# Altium schematic sheet SFP_TEMP_EEPROM_GPIO.SchDoc
size C; CompanyName: Atom Computing; Organization: Altium Limited; Address1: 918 Parker St.; Address2: Suite A-13; Address3: Berkeley, CA; Address4: 94710; Revision: B.2; SheetNumber: 4; SheetTotal: 4; PageSetup: Record=PageOptions|CenterHorizontal=True|CenterVertical=True|PrintScale=1.09|XCorrection=1.00|YCorrection=1.00|PrintKind=1|BorderSize=5000000|LeftOffset=0|BottomOffset=0|Orientation=2|PaperLength=4318|PaperWidth=2794|Scale=100|PaperSource=1025|PrintQuality=600|MediaType=256|DitherType=0|PrintScaleMode=1|PaperKind=11" x 17"|PaperIndex=17; Size: C; DescriptionA: ENGINEERING RELEASE; ReleaseYear: 2024; BoardTitle: MICRO HDMI INTERFACE
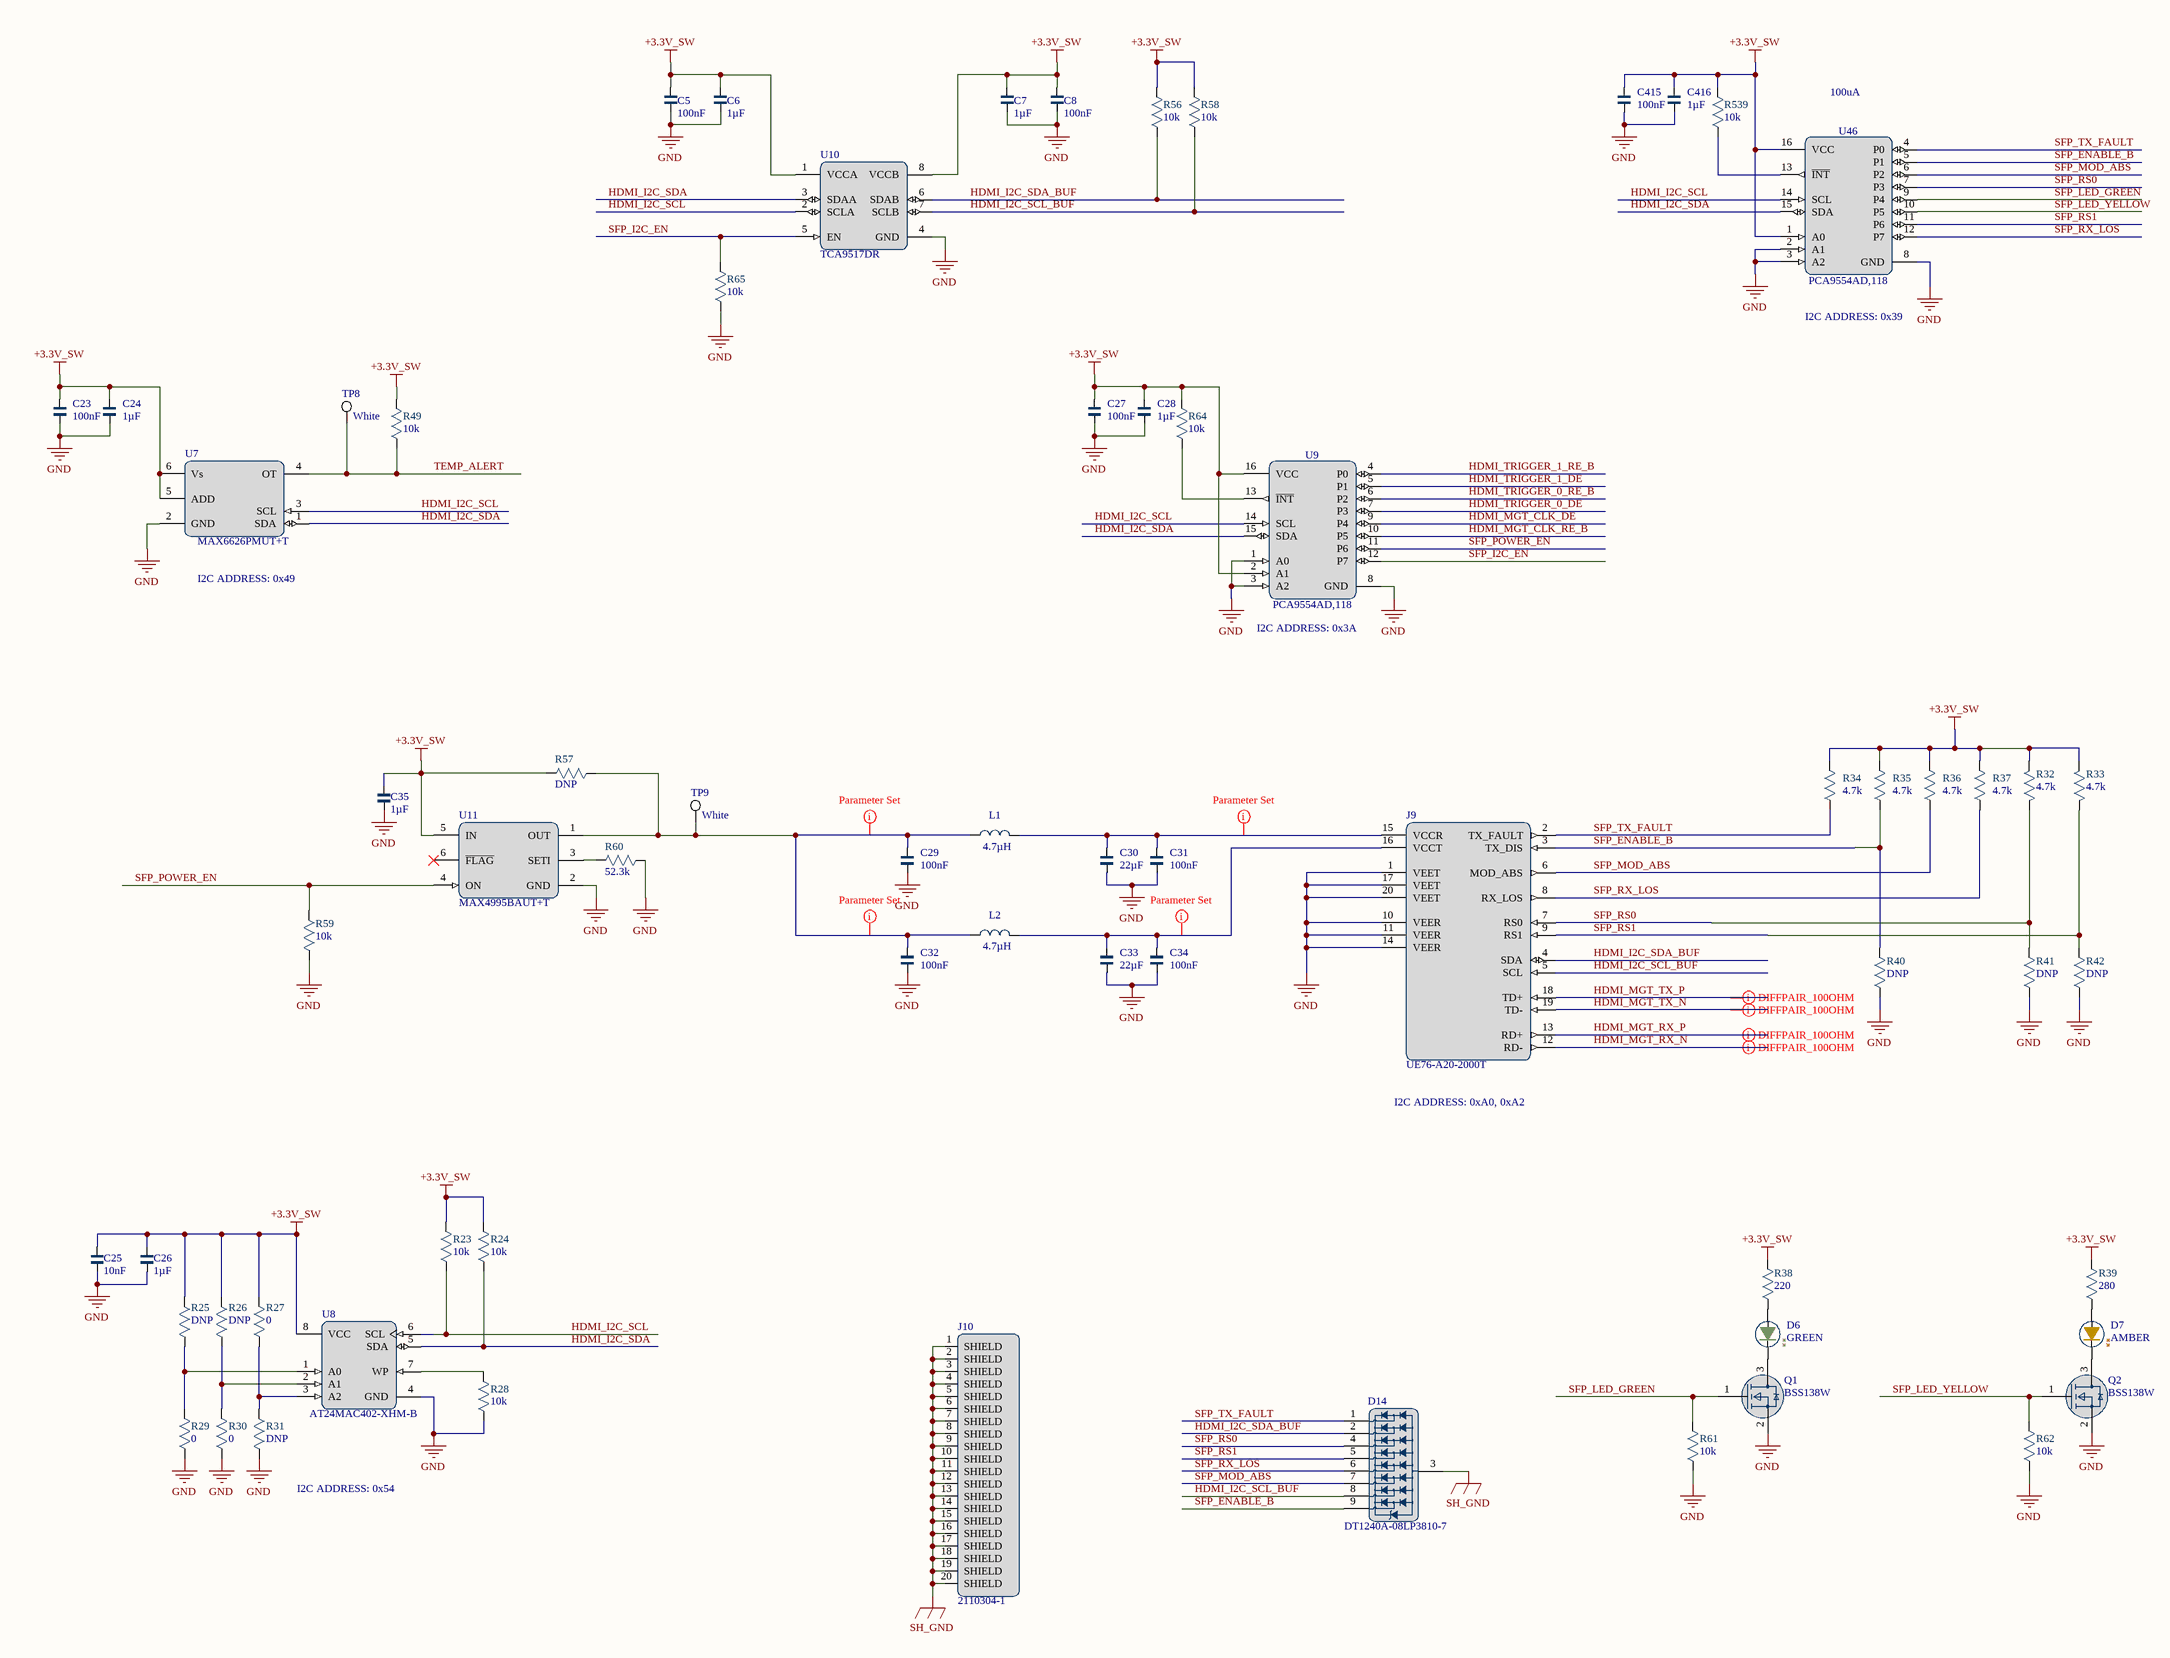
[diagram p0: SFP_TEMP_EEPROM_GPIO.SchDoc]

## Parts
C5  100nF  [CAPC160X80X95L35]
C6  1µF  [CAPC160X80X95L35]
C7  1µF  [CAPC160X80X95L35]
C8  100nF  [CAPC160X80X95L35]
C23  100nF  [CAPC160X80X95L35]
C24  1µF  [CAPC160X80X95L35]
C25  10nF  [CAPC160X80X95L35]
C26  1µF  [CAPC160X80X95L35]
C27  100nF  [CAPC160X80X95L35]
C28  1µF  [CAPC160X80X95L35]
C29  100nF  [CAPC160X80X95L35]
C30  22µF  [CAPC320X160X90L50]
C31  100nF  [CAPC160X80X95L35]
C32  100nF  [CAPC160X80X95L35]
C33  22µF  [CAPC320X160X90L50]
C34  100nF  [CAPC160X80X95L35]
C35  1µF  [CAPC160X80X95L35]
C415  100nF  [CAPC160X80X95L35]
C416  1µF  [CAPC160X80X95L35]
D6  GREEN  [BROADCOM_HSMX-C120]
D7  AMBER  [BROADCOM_HSMX-C120]
D14  DT1240A-08LP3810-7  [DIODES_DT1240A-08LP3810-7]
J9  UE76-A20-2000T  [AMPHENOL_UX76-A20-X00XX]
J10  2110304-1  [TE_2110304-1_NO_KEEPOUT]
L1  4.7µH  [VISHAY_IHLP-2020BZ]
L2  4.7µH  [VISHAY_IHLP-2020BZ]
Q1  BSS138W  [SOT23-3P65_210X110L36X22]
Q2  BSS138W  [SOT23-3P65_210X110L36X22]
R23  10k  [RESC160X85X55L30]
R24  10k  [RESC160X85X55L30]
R25  DNP  [RESC160X85X55L30]
R26  DNP  [RESC160X85X55L30]
R27  0  [RESC160X85X55L30]
R28  10k  [RESC160X85X55L30]
R29  0  [RESC160X85X55L30]
R30  0  [RESC160X85X55L30]
R31  DNP  [RESC160X85X55L30]
R32  4.7k  [RESC160X85X55L30]
R33  4.7k  [RESC160X85X55L30]
R34  4.7k  [RESC160X85X55L30]
R35  4.7k  [RESC160X85X55L30]
R36  4.7k  [RESC160X85X55L30]
R37  4.7k  [RESC160X85X55L30]
R38  220  [RESC160X85X55L30]
R39  280  [RESC160X85X55L30]
R40  DNP  [RESC160X85X55L30]
R41  DNP  [RESC160X85X55L30]
R42  DNP  [RESC160X85X55L30]
R49  10k  [RESC160X85X55L30]
R56  10k  [RESC160X85X55L30]
R57  DNP  [RESC160X85X55L30]
R58  10k  [RESC160X85X55L30]
R59  10k  [RESC160X85X55L30]
R60  52.3k  [RESC160X85X55L30]
R61  10k  [RESC160X85X55L30]
R62  10k  [RESC160X85X55L30]
R64  10k  [RESC160X85X55L30]
R65  10k  [RESC160X85X55L30]
R539  10k  [RESC160X85X55L30]
TP8  White  [Keystone_5002]
TP9  White  [Keystone_5002]
U7  MAX6626PMUT+T  [SOT23-6P95_280X145L45X42]
U8  AT24MAC402-XHM-B  [SOP8P65_300X640X120L60X24]
U9  PCA9554AD,118  [SOIC16P127_1030X1032X265L83X42]
U10  TCA9517DR  [SOIC8P127_490X599X175L84X41]
U11  MAX4995BAUT+T  [SOT23-6P95_280X145L45X42]
U46  PCA9554AD,118  [SOIC16P127_1030X1032X265L83X42]

## Nets
+3.3V_SW: C5.1 C6.1 C7.1 C8.1 C23.1 C24.1 C25.1 C26.1 C27.1 C28.1 C35.1 C415.1 C416.2 R23.2 R24.2 R25.1 R26.1 R27.2 R32.2 R33.2 R34.2 R35.2 R36.2 R37.2 R38.2 R39.2 R49.2 R56.2 R57.2 R58.2 R64.2 R539.2 U7.5(ADD) U7.6(Vs) U8.8(VCC) U9.2(A1) U9.16(VCC) U10.1(VCCA) U10.8(VCCB) U11.5(IN) U46.1(A0) U46.16(VCC)
GND: C5.2 C6.2 C7.2 C8.2 C23.2 C24.2 C25.2 C26.2 C27.2 C28.2 C29.2 C30.2 C31.2 C32.2 C33.2 C34.2 C35.2 C415.2 C416.1 J9.1(VEET) J9.10(VEER) J9.11(VEER) J9.14(VEER) J9.17(VEET) J9.20(VEET) Q1.2(SOURCE) Q2.2(SOURCE) R28.1 R29.1 R30.1 R31.2 R40.1 R41.1 R42.1 R59.2 R60.1 R61.1 R62.1 R65.1 U7.2(GND) U8.4(GND) U9.1(A0) U9.3(A2) U9.8(GND) U10.4(GND) U11.2(GND) U46.2(A1) U46.3(A2) U46.8(GND)
SH_GND: D14.3(GND) J10.1(SHIELD) J10.2(SHIELD) J10.3(SHIELD) J10.4(SHIELD) J10.5(SHIELD) J10.6(SHIELD) J10.7(SHIELD) J10.8(SHIELD) J10.9(SHIELD) J10.10(SHIELD) J10.11(SHIELD) J10.12(SHIELD) J10.13(SHIELD) J10.14(SHIELD) J10.15(SHIELD) J10.16(SHIELD) J10.17(SHIELD) J10.18(SHIELD) J10.19(SHIELD) J10.20(SHIELD)
HDMI_I2C_SCL: R23.1 U7.3(SCL) U8.6(SCL) U9.14(SCL) U10.2(SCLA) U46.14(SCL)
HDMI_I2C_SCL_BUF: D14.8(LINE-4) J9.5(SCL) R58.1 U10.7(SCLB)
HDMI_I2C_SDA: R24.1 U7.1(SDA) U8.5(SDA) U9.15(SDA) U10.3(SDAA) U46.15(SDA)
HDMI_I2C_SDA_BUF: D14.2(LINE-3) J9.4(SDA) R56.1 U10.6(SDAB)
HDMI_MGT_CLK_DE: U9.9(P4)
HDMI_MGT_CLK_RE_B: U9.10(P5)
HDMI_MGT_RX_N: J9.12(RD-)
HDMI_MGT_RX_P: J9.13(RD+)
HDMI_MGT_TX_N: J9.19(TD-)
HDMI_MGT_TX_P: J9.18(TD+)
HDMI_TRIGGER_0_DE: U9.7(P3)
HDMI_TRIGGER_0_RE_B: U9.6(P2)
HDMI_TRIGGER_1_DE: U9.5(P1)
HDMI_TRIGGER_1_RE_B: U9.4(P0)
SFP_ENABLE_B: D14.9(LINE-2) J9.3(TX_DIS) R35.1 R40.2 U46.5(P1)
SFP_I2C_EN: R65.2 U9.12(P7) U10.5(EN)
SFP_LED_GREEN: Q1.1(GATE) R61.2 U46.9(P4)
SFP_LED_YELLOW: Q2.1(GATE) R62.2 U46.10(P5)
SFP_MOD_ABS: D14.7(LINE-5) J9.6(MOD_ABS) R36.1 U46.6(P2)
SFP_POWER_EN: R59.1 U9.11(P6) U11.4(ON)
SFP_RS0: D14.4(LINE-6) J9.7(RS0) R32.1 R41.2 U46.7(P3)
SFP_RS1: D14.5(LINE-8) J9.9(RS1) R33.1 R42.2 U46.11(P6)
SFP_RX_LOS: D14.6(LINE-7) J9.8(RX_LOS) R37.1 U46.12(P7)
SFP_TX_FAULT: D14.1(LINE-1) J9.2(TX_FAULT) R34.1 U46.4(P0)
TEMP_ALERT: R49.1 TP8.1 U7.4(OT)
NetC29_1: C29.1 C32.1 L1.1 L2.1 R57.1 TP9.1 U11.1(OUT)
NetC30_1: C30.1 C31.1 J9.15(VCCR) L1.2
NetC33_1: C33.1 C34.1 J9.16(VCCT) L2.2
NetD6_1: D6.1 Q1.3(DRAIN)
NetD6_2: D6.2 R38.1
NetD7_1: D7.1 Q2.3(DRAIN)
NetD7_2: D7.2 R39.1
NetR25_2: R25.2 R29.2 U8.1(A0)
NetR26_2: R26.2 R30.2 U8.2(A1)
NetR27_1: R27.1 R31.1 U8.3(A2)
NetR28_2: R28.2 U8.7(WP)
NetR60_2: R60.2 U11.3(SETI)
NetR64_1: R64.1 U9.13(~{INT})
NetR539_1: R539.1 U46.13(~{INT})

Not connected (* = marked no-connect by the designer): U11 6(~{FLAG})*

## Layout directives
net class P-G: NetC29_1, NetC30_1, NetC33_1
differential pair; differential pair class 100DIFF: HDMI_MGT_RX_N, HDMI_MGT_RX_P, HDMI_MGT_TX_N, HDMI_MGT_TX_P

## Notes on the sheet
- 100uA
- I2C ADDRESS: 0x39
- I2C ADDRESS: 0x49
- (near U9) I2C ADDRESS: 0x3A
- I2C ADDRESS: 0xA0, 0xA2
- I2C ADDRESS: 0x54
- SCHEMATIC,
- "This documentation describes Open Hardware and is licensed under the CC BY-SA 4.0. You may redistribute and modify this documentation under the terms of
- CC BY-SA 4.0. (https://creativecommons.org/licenses/by-sa/4.0/). This documentation is distributed WITHOUT ANY EXPRESS OR IMPLIED WARRANTY,
- INCLUDING OF MERCHANTABILITY, SATISFACTORY QUALITY AND FITNESS FOR A PARTICULAR PURPOSE."  COPYRIGHT ©
- Atom Computing, Inc.
- ,
- SIZE
- FILE NAME
- PAGE
- OF
- REV

## Library data of the parts
C5 C8 C23 C27 = CMP-001-00143-7: CAP CER 0.1UF 25V X7R 0603; Mfg: Kemet; Tolerance: 10%; Mfg PN: C0603X104K3RACTU; Voltage: 25V; Pins: 2; VALUE: 100nF; Case/Package: 0603; Temp Coeff: X7R
C6 C7 C24 C28 = CMP-001-00135-7: CAP CER 1uF 10V 10% 0603; Op Temp: -55°C ~ 85°C; Mfg PN: C0603C105K8PACTU; Temp Coeff: X5R; Mfg: Kemet; VALUE: 1µF; Voltage: 10V; Tolerance: 10%; Case/Package: 0603; Pins: 2
C25 = CMP-001-00168-8: CAP CER 10000PF 50V C0G 0603; Mfg PN: C1608C0G1H103J080AA; Mfg: TDK Corporation; Tolerance: 5%; Temp Coeff: C0G/NP0; VALUE: 10nF; Voltage: 50V; Case/Package: 0603; Pins: 2
C26 C35 = CMP-001-00135-7: CAP CER 1uF 10V 10% 0603; Mfg PN: C0603C105K8PACTU; Mfg: Kemet; Temp Coeff: X5R; Op Temp: -55°C ~ 85°C; VALUE: 1µF; Tolerance: 10%; Voltage: 10V; Case/Package: 0603; Pins: 2
C29 C31 C32 C34 C415 = CMP-001-00143-7: CAP CER 0.1UF 25V X7R 0603; Mfg PN: C0603X104K3RACTU; Mfg: Kemet; Tolerance: 10%; VALUE: 100nF; Case/Package: 0603; Pins: 2; Temp Coeff: X7R; Voltage: 25V
C30 C33 = CMP-001-00066-8: CAP CER 22UF 10V X7R 1206; Mfg PN: GRM31CR71A226KE15L; Mfg: MURATA; Tolerance: 10%; VALUE: 22µF; Voltage: 10V; Pins: 2; Temp Coeff: X7R; Case/Package: 1206
C416 = CMP-001-00173-8: ±10% 35V Ceramic Capacitor X7R 0603 (1608 Metric); Mfg: TDK Corporation; Mfg PN: C1608X7R1V105K080AE; VALUE: 1µF; Pins: 2; Temp Coeff: X7R; Case/Package: 0603
D6 = CMP-004-00020-5: LED GREEN CLEAR CHIP SMD R/A; Mfg: AVAGO TECHNOLOGIES; Mfg PN: HSME-C120; Forward Voltage: 2.1V; Value: GREEN; Case/Package: 2-SMD; Pins: 2; Mounting Technology: Surface Mount; Nominal Vf: 2.1V; RoHS Compliant: Yes
D7 = CMP-007-00001-2: LED AMBER CLEAR CHIP SMD R/A 0603; Mfg: Broadcom Limited; Nominal Vf: 1.9V; Forward Current: 25mA; Forward Voltage: 2.4V; Mfg PN: HSMA-C120; Mounting Technology: Surface Mount; RoHS Compliant: Yes; Case/Package: 0603; Max Operating Temperature: 85°C; Min Operating Temperature: -30°C; Pins: 2; Value: AMBER
D14 = CMP-0037-00000-1: TVS DIODE 3.3VWM 10V U-DFN3810-9; Voltage - Breakdown: 5V; Mfg: Diodes Incorporated; Current - Peak Pulse: 5.5A (8/20µs); Voltage - Reverse Standoff: 3.3V; Case/Package: 9-UDFN; Mfg PN: DT1240A-08LP3810-7; Mounting Technology: Surface Mount; Max Operating Temperature: 85°C; Voltage - Clamping: 10V; RoHS Compliant: Yes; Min Operating Temperature: -55°C; Pins: 9
J9 = CMP-002-00059-2: 20 Position SFP+ Receptacle Connector Solder Surface Mount, Right Angle; Gender: Female; Mfg: Amphenol ICC (Commercial Products); Mounting Technology: Surface Mount; Mfg PN: UE76-A20-2000T; Connector Type: SFP+; Case/Package: 0.8mm; Pins: 20; RoHS Compliant: Yes
J10 = CMP-002-00063-3: Position SFP+ Cage Connector Solder Through Hole, Right Angle; Mfg: TE Connectivity AMP Connectors; RoHS Compliant: Yes; Pins: 20; Connector Type: SFP+ Cage; Case/Package: None; Mfg PN: 2110304-1
L1 L2 = CMP-006-00015-5: FIXED IND 4.7UH 3.2A 81.3 MOHM; Mfg PN: IHLP2020BZER4R7M11; Mfg: Vishay Dale; Tolerance: 20%; Self Resonant Frequency: 27MHz; DCR: 81.3m; Saturation Current: 3A; VALUE: 4.7µH; Pins: 2; Case/Package: SMD; Min Operating Temperature: -55°C; Current Rating: 3.2A; Max Operating Temperature: 125°C; Mounting Technology: Surface Mount; Height: 2.0mm
Q1 Q2 = CMP-479-000010-1: MOSFET N-CH 50V 210MA SC70; Current Rating: 0.210A; Mfg: ON SEMICONDUCTOR; Mfg PN: BSS138W; Voltage: 50V; Pin Count: 3; Package: SC70
R23 R24 R28 R49 R56 R58 R61 R62 R64 R65 R539 = CMP-009-00475-2: RES SMD 10K OHM 1% 1/10W 0603; Mfg PN: ERJ-3EKF1002V; Mfg: Panasonic Electronic Components; Power: 100mW; VALUE: 10k; Tolerance: 1%; Mounting Technology: Surface Mount; Min Operating Temperature: -55°C; Max Operating Temperature: 155°C; Case/Package: 0603; Pins: 2; RoHS Compliant: Yes
R25 R26 R31 R40-R42 R57 = CMP-009-00057-4: DNP, RES 0603; Mfg PN: DNP_RES_0603; Mfg: DNP; VALUE: DNP; Case/Package: 0603; Pins: 2
R27 R29 R30 = CMP-009-00290-2: RES 0 OHM JUMPER 1/10W 0603; Mfg PN: RC0603FR-070RL; Mfg: Yageo; VALUE: 0; Pins: 2; Case/Package: 0603
R32-R37 = CMP-009-00307-2: RES SMD 4.7K OHM 1% 1/10W 0603; Mfg PN: RC0603FR-074K7L; Mfg: Yageo; VALUE: 4.7k; Case/Package: 0603; Pins: 2
R38 = CMP-009-00297-2: RES SMD 220 OHM 1% 1/10W 0603; Mfg: Yageo; Mfg PN: RC0603FR-07220RL; Case/Package: 0603; VALUE: 220; Pins: 2
R39 = CMP-009-00554-1: RES SMD 280 OHM 1% 1/10W 0603; Mfg: Panasonic Electronic Components; Mfg PN: ERJ-3EKF2800V; Power: 100mW; Case/Package: 0603; Value: 280; Pins: 2; RoHS Compliant: Yes; Mounting Technology: Surface Mount; Min Operating Temperature: -55°C; Max Operating Temperature: 155°C; Tolerance: 1%
R59 = CMP-009-00475-2: RES SMD 10K OHM 1% 1/10W 0603; Mfg: Panasonic Electronic Components; Mfg PN: ERJ-3EKF1002V; Power: 100mW; VALUE: 10k; Case/Package: 0603; RoHS Compliant: Yes; Pins: 2; Max Operating Temperature: 155°C; Min Operating Temperature: -55°C; Tolerance: 1%; Mounting Technology: Surface Mount
R60 = CMP-009-00432-2: RES SMD 52.3K 0.1% 1/10W 0603; Mfg PN: RT0603BRD0752K3L; Mfg: Yageo; Case/Package: 0603; VALUE: 52.3k; Pins: 2
TP8 TP9 = CMP-00030-00002-6: Test Point, White, 1-Pin THD, RoHS, Bulk; Mfg PN: 5002; Mfg: Keystone; Pins: 1; Value: White
U7 = CMP-010-00002-3: Temperature Sensor Digital, Local -55°C ~ 125°C 12 b SOT-6; Mfg: Maxim; Max Supply Voltage: 5.5V; Sensor Type: TEMPERATURE SENSOR,SWITCH/DIGITAL OUTPUT,SERIAL; Min Supply Voltage: 3V; Mfg PN: MAX6626PMUT+T; Max Operating Temperature: 125°C; RoHS Compliant: Yes; Case/Package: SOT-23-6; Min Operating Temperature: -55°C; Mounting Technology: Surface Mount; Pins: 6
U8 = CMP-019-00010-2: IC EEPROM  MAC 48 2KBIT I2C 1MHZ 8TSSOP; Mfg: Microchip Technology; Min Supply Voltage: 1.7V; Memory Size: 256; Max Supply Voltage: 5.5V; Mfg PN: AT24MAC402-XHM-B; Max Operating Temperature: 85°C; Clock Frequency: 1MHz; Mounting Technology: Surface Mount; Case/Package: TSSOP; Pins: 8; Min Operating Temperature: -40°C; Memory Format: EEPROM; RoHS Compliant: Yes
U9 U46 = CMP-015-00018-4: I/O GPIO Expander 8 I2C, SMBus 400 kHz 16-SO; Max Supply Voltage: 5.5V; Min Supply Voltage: 2.3V; Nominal Supply Voltage: 3V; Mfg: NXP USA Inc.; RoHS Compliant: Yes; Min Operating Temperature: -40°C; Max Operating Temperature: 85°C; Mfg PN: PCA9554AD,118; Mounting Technology: Surface Mount; Pins: 16; Case/Package: 16-SOIC
U10 = CMP-015-00020-1: Voltage Level Translator Bidirectional 1 Circuit 2 Channel 8-SOIC; Max Supply Voltage: 5.5V; Min Supply Voltage: 900mV; Nominal Supply Voltage: 3.3V; Mfg: Texas Instruments; Case/Package: 8-SOIC; Mfg PN: TCA9517DR; RoHS Compliant: Yes; Max Operating Temperature: 85°C; Mounting Technology: Surface Mount; Min Operating Temperature: -40°C; Pins: 8
U11 = CMP-035-00005-1: IC CURRENT SWITCH ADJ 10% SOT-23-6; Max Supply Voltage: 5.5V; Min Supply Voltage: 1.7V; Mfg: Analog Devices Inc./Maxim Integrated; Mfg PN: MAX4995BAUT+T; Case/Package: SOT-23-6; RoHS Compliant: Yes; Min Operating Temperature: -40°C; Max Operating Temperature: 125°C; Mounting Technology: Surface Mount; Pins: 6